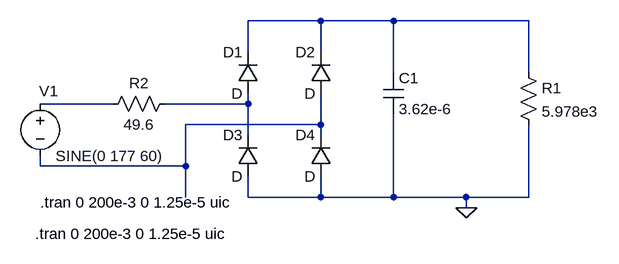
[diagram p0: schematic cfl_equiv.asc]
cfl_equiv.asc, the LTspice schematic file:
Version 4
SHEET 1 880 680
WIRE 240 32 128 32
WIRE 352 32 240 32
WIRE 560 32 352 32
WIRE 128 80 128 32
WIRE 240 80 240 32
WIRE 352 112 352 32
WIRE 560 112 560 32
WIRE -80 160 -192 160
WIRE 128 160 128 144
WIRE 128 160 0 160
WIRE 240 192 240 144
WIRE 240 192 32 192
WIRE 128 208 128 160
WIRE 240 208 240 192
WIRE -192 256 -192 240
WIRE 32 256 32 192
WIRE 32 256 -192 256
<<<<<<< HEAD
=======
WIRE 32 304 32 256
>>>>>>> 344d5226b35a6b36a0f21c15974e6583a41fff00
WIRE 128 304 128 272
WIRE 240 304 240 272
WIRE 240 304 128 304
WIRE 352 304 352 176
WIRE 352 304 240 304
WIRE 464 304 352 304
WIRE 560 304 560 192
WIRE 560 304 464 304
WIRE 464 320 464 304
FLAG 464 320 0
SYMBOL res 544 96 R0
SYMATTR InstName R1
SYMATTR Value 5.978e3
SYMBOL diode 144 144 R180
WINDOW 0 24 64 Left 2
WINDOW 3 24 0 Left 2
SYMATTR InstName D1
SYMBOL diode 256 144 R180
WINDOW 0 24 64 Left 2
WINDOW 3 24 0 Left 2
SYMATTR InstName D2
SYMBOL diode 144 272 R180
WINDOW 0 24 64 Left 2
WINDOW 3 24 0 Left 2
SYMATTR InstName D3
SYMBOL diode 256 272 R180
WINDOW 0 24 64 Left 2
WINDOW 3 24 0 Left 2
SYMATTR InstName D4
SYMBOL cap 336 112 R0
SYMATTR InstName C1
SYMATTR Value 3.62e-6
SYMBOL res -96 176 R270
WINDOW 0 32 56 VTop 2
WINDOW 3 0 56 VBottom 2
SYMATTR InstName R2
SYMATTR Value 49.6
SYMBOL voltage -192 144 R0
WINDOW 123 0 0 Left 0
WINDOW 39 0 0 Left 0
<<<<<<< HEAD
WINDOW 0 -2 -4 Left 2
SYMATTR InstName V1
SYMATTR Value SINE(0 177 60)
TEXT -200 360 Left 2 !.tran 0 200e-3 0 1.25e-5 uic
=======
SYMATTR InstName V1
SYMATTR Value SINE(0 177 60)
TEXT -192 312 Left 2 !.tran 0 200e-3 0 1.25e-5 uic
>>>>>>> 344d5226b35a6b36a0f21c15974e6583a41fff00

The netlist it stands for:
* cfl_equiv.asc
R1 N001 0 5.978e3
D1 N003 N001 D
D2 N004 N001 D
D3 0 N003 D
D4 0 N004 D
C1 N001 0 3.62e-6
R2 N002 N003 49.6
V1 N002 N004 SINE(0 177 60)
.model D D
.lib standard.dio
.tran 0 200e-3 0 1.25e-5 uic
.tran 0 200e-3 0 1.25e-5 uic
.backanno
.end